# Altium schematic sheet Buffer.SchDoc: ThunderScope 1000E
size A4; DrawnBy: Aleksa Bjelogrlic; Revision: 1
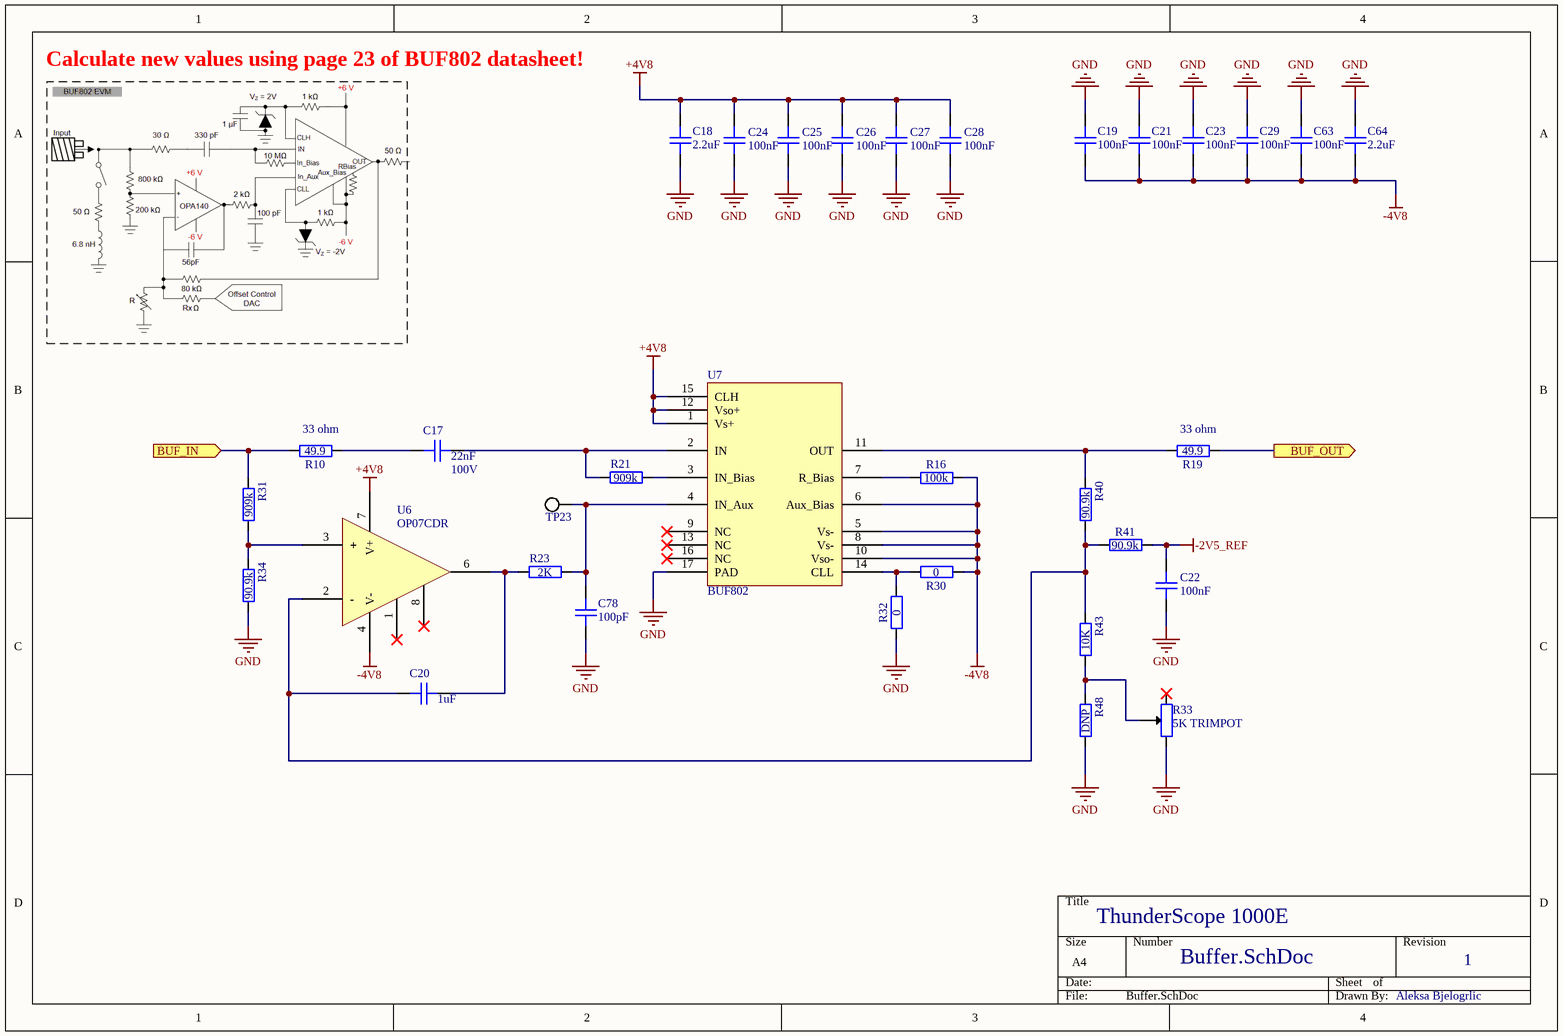
[diagram p0: Buffer.SchDoc]

## Parts
C17  22nF  Voltage Rating: 100V  [GEN_C_0603]
C18  2.2uF  [GEN_C_0402]
C19  100nF  [GEN_C_0402]
C20  1uF  [GEN_C_0402]
C21  100nF  [GEN_C_0402]
C22  100nF  [GEN_C_0402]
C23  100nF  [GEN_C_0402]
C24  100nF  [GEN_C_0402]
C25  100nF  [GEN_C_0402]
C26  100nF  [GEN_C_0402]
C27  100nF  [GEN_C_0402]
C28  100nF  [GEN_C_0402]
C29  100nF  [GEN_C_0402]
C63  100nF  [GEN_C_0402]
C64  2.2uF  [GEN_C_0402]
C78  100pF  [GEN_C_0402]
R10  49.9  [GEN_R_0402]
R16  100k  [GEN_R_0402]
R19  49.9  [GEN_R_0402]
R21  909k  [GEN_R_0402]
R23  2K  [GEN_R_0402]
R30  0  [GEN_R_0402]
R31  909k  [GEN_R_0402]
R32  0  [GEN_R_0402]
R33  5K TRIMPOT  [BOU_3mm_POT]
R34  90.9k  [GEN_R_0402]
R40  90.9k  [GEN_R_0402]
R41  90.9k  [GEN_R_0402]
R43  10K  [GEN_R_0402]
R48  DNP  [GEN_R_0402]  (no BOM)
TP23  PCB  [GEN_TP_PCB]  (value not drawn)  (no BOM)
U6  OP07CDR  [TI_SOIC8_D0008A]
U7  BUF802  [TI_VQFN_RGT0016C]

## Ports
BUF_IN (in), BUF_OUT (out)

## Nets
+4V8: C18.2 C24.1 C25.1 C26.1 C27.2 C28.2 U6.7(V+) U7.1(Vs+) U7.12(Vso+) U7.15(CLH)
-2V5_REF: C22.1 R41.1
-4V8: C19.2 C21.2 C23.1 C29.1 C63.1 C64.2 R16.2 R30.1 U6.4(V-) U7.5(Vs-) U7.6(Aux_Bias) U7.8(Vs-) U7.10(Vso-)
GND: C18.1 C19.1 C21.1 C22.2 C23.2 C24.2 C25.2 C26.2 C27.1 C28.1 C29.2 C63.2 C64.1 C78.1 R32.1 R33.3 R34.1 R48.1 U7.17(PAD)
BUF_IN: R10.1 R31.2 ; port BUF_IN
BUF_OUT: R19.2 ; port BUF_OUT
NetC17_1: C17.1 R21.2 U7.2(IN)
NetC17_2: C17.2 R10.2
NetC20_1: C20.1 R23.2 U6.6(OUT)
NetC20_2: C20.2 R40.1 R41.2 R43.2 U6.2(-)
NetC78_2: C78.2 R23.1 TP23.1 U7.4(IN_Aux)
NetR16_1: R16.1 U7.7(R_Bias)
NetR19_1: R19.1 R40.2 U7.11(OUT)
NetR21_1: R21.1 U7.3(IN_Bias)
NetR30_2: R30.2 R32.2 U7.14(CLL)
NetR31_1: R31.1 R34.2 U6.3(+)
NetR33_2: R33.2 R43.1 R48.2

Not connected (* = marked no-connect by the designer): R33 1*; U6 1(N1)* 8(N2)*; U7 9(NC)* 13(NC)* 16(NC)*

## Notes on the sheet
- Calculate new values using page 23 of BUF802 datasheet!
- (near R10) 33 ohm
- (near R19) 33 ohm
- Aleksa Bjelogrlic

## Library data of the parts
C17 = CAP 22nF 100V X7R 0603: Package: 0603; Value: 22nF; Supplier 1: Digi-Key; Supplier Part Number 1: 490-4782-1-ND
C18 C64 = CAP 2.2uF 10V X5R 0402: Voltage Rating: 10V; Package: 0402; Supplier 1: Digi-Key; Supplier Part Number 1: 587-3153-1-ND; Value: 2.2uF
C19 C21-C29 C63 = CAP 100nF 16V X7R 0402: Voltage Rating: 16V; Package: 0402; Supplier 1: Digi-Key; Supplier Part Number 1: 490-4759-1-ND; Value: 100nF
C20 = CAP 1uF 25V X5R 0402: Voltage Rating: 25V; Package: 0402; Supplier 1: Digi-Key; Supplier Part Number 1: 490-10017-1-ND; Value: 1uF
C78 = CAP 100pF 50V C0G 0402: Temperature Coefficient: C0G; Voltage Rating: 50V; Package: 0402; Value: 100pF; Supplier 1: Digi-Key; Supplier Part Number 1: 490-14349-1-ND
R10 R19 = RES 49.9 OHM 1% 1/10W 0402: Tolerance: 1%; Power Rating: 0.1W; Package: 0402; Supplier 1: Digi-Key; Supplier Part Number 1: 311-49.9LRCT-ND; Value: 49.9
R16 = RES 100K OHM 1% 1/10W 0402: Tolerance: 1%; Power Rating: 0.1W; Package: 0402; Value: 100k; Supplier 1: Digi-Key; Supplier Part Number 1: 311-100KLRCT-ND
R21 R31 = RES 909K OHM 1% 1/16W 0402: Tolerance: 1%; Power Rating: 0.0625W; Package: 0402; Supplier 1: Digi-Key; Supplier Part Number 1: YAG2377CT-ND; Value: 909k
R23 = RES 2K OHM 1% 1/16W 0402: Tolerance: 1%; Power Rating: 0.0625W; Package: 0402; Supplier 1: Digi-Key; Supplier Part Number 1: 311-2KLRCT-ND; Value: 2K
R30 R32 = RES 0 OHM 1/16W 0402: Power Rating: 0.0625W; Package: 0402; Supplier 1: Digi-Key; Supplier Part Number 1: 311-0.0JRCT-ND; Value: 0
R33 = TRIMMER 5K OHM 0.1W J LEAD TOP: Tolerance: 1%; Power Rating: 0.1W; Supplier 1: Digi-Key; Supplier Part Number 1: TC33X-502ECT-ND; Value: 5K
R34 R40 R41 = RES 90.9K OHM 1% 1/16W 0402: Tolerance: 1%; Power Rating: 0.0625W; Package: 0402; Supplier 1: Digi-Key; Supplier Part Number 1: 311-90.9KLRCT-ND; Value: 90.9k
R43 = RES 10K OHM 1% 1/10W 0402: Tolerance: 1%; Power Rating: 0.1W; Package: 0402; Supplier 1: Digi-Key; Supplier Part Number 1: P10.0KLCT-ND; Value: 10K
R48 = RES DNP 0402: Tolerance: 1%; Power Rating: 0.0625W; Package: 0402; Value: DNP
TP23 = TP PCB 1mm
U6 = IC OPAMP OP07CDR: Supplier 1: Digi-Key; Supplier Part Number 1: 296-14626-1-ND
U7 = IC BUFFER AMP BUF802